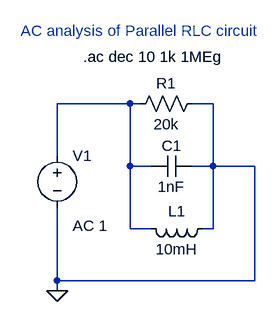
[diagram p0: schematic parallelRLCAC.asc]
parallelRLCAC.asc, the LTspice schematic file:
Version 4.1
SHEET 1 880 680
WIRE 192 64 80 64
WIRE 208 64 192 64
WIRE 320 64 288 64
WIRE 80 144 80 64
WIRE 192 160 192 64
WIRE 224 160 192 160
WIRE 320 160 320 64
WIRE 320 160 288 160
WIRE 384 160 320 160
WIRE 192 256 192 160
WIRE 224 256 192 256
WIRE 320 256 320 160
WIRE 320 256 304 256
WIRE 80 336 80 224
WIRE 384 336 384 160
WIRE 384 336 80 336
WIRE 80 352 80 336
FLAG 80 352 0
SYMBOL voltage 80 128 R0
WINDOW 123 24 124 Left 2
WINDOW 39 0 0 Left 0
SYMATTR InstName V1
SYMATTR Value ""
SYMATTR Value2 AC 1
SYMBOL res 304 48 R90
WINDOW 0 0 56 VBottom 2
WINDOW 3 32 56 VTop 2
SYMATTR InstName R1
SYMATTR Value 20k
SYMBOL cap 288 144 R90
WINDOW 0 0 32 VBottom 2
WINDOW 3 32 32 VTop 2
SYMATTR InstName C1
SYMATTR Value 1nF
SYMBOL ind 320 240 R90
WINDOW 0 5 56 VBottom 2
WINDOW 3 32 56 VTop 2
SYMATTR InstName L1
SYMATTR Value 10mH
TEXT 24 -48 Left 2 ;AC analysis of Parallel RLC circuit
TEXT 120 -8 Left 2 !.ac dec 10 1k 1MEg

The netlist it stands for:
* parallelRLCAC.asc
V1 N001 0 AC 1
R1 0 N001 20k
C1 0 N001 1nF
L1 0 N001 10mH
* AC analysis of Parallel RLC circuit
.ac dec 10 1k 1MEg
.backanno
.end